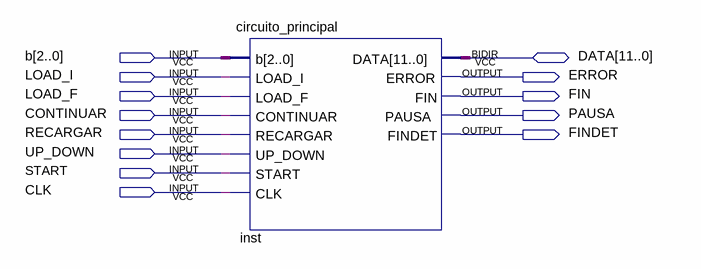
[diagram p0: schematic sheet]
// Quartus schematic circuito_principal_bloque.bdf as structural Verilog: 1 symbols, 13 pins
module circuito_principal_bloque (
  input  [2:0] b,
  input  LOAD_I,
  input  LOAD_F,
  input  CONTINUAR,
  input  RECARGAR,
  input  UP_DOWN,
  input  START,
  input  CLK,
  inout  [11:0] DATA,
  output ERROR,
  output FIN,
  output PAUSA,
  output FINDET
);

  circuito_principal inst (
    .b(b), .LOAD_I(LOAD_I), .LOAD_F(LOAD_F), .CONTINUAR(CONTINUAR), .RECARGAR(RECARGAR), .UP_DOWN(UP_DOWN),
    .START(START), .CLK(CLK), .ERROR(ERROR), .FIN(FIN), .PAUSA(PAUSA), .FINDET(FINDET), .DATA(DATA));
endmodule
